# Altium schematic sheet VESC_KS75600_main_power.SchDoc
size A3; SheetNumber: 2; SheetTotal: 5
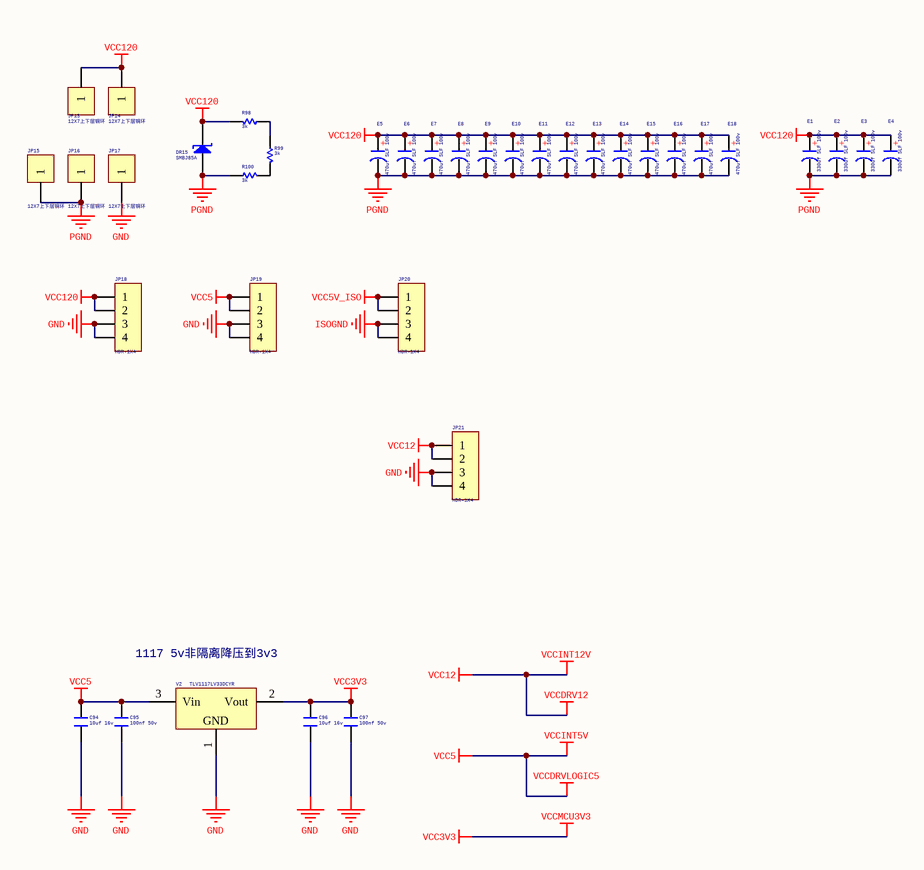
[diagram p0: VESC_KS75600_main_power.SchDoc]

## Parts
C94  10uf 16v  [C 0805]
C95  100nf 50v  [C 0603]
C96  10uf 16v  [C 0805]
C97  100nf 50v  [C 0603]
DR15  SMBJ85A  [SMB]
E1  330uf SLF 100v  [CAP 5.0*13.5*26]
E2  330uf SLF 100v  [CAP 5.0*13.5*26]
E3  330uf SLF 100v  [CAP 5.0*13.5*26]
E4  330uf SLF 100v  [CAP 5.0*13.5*26]
E5  470uf SLF 100v  [CAP 7.5*16.5*27]
E6  470uf SLF 100v  [CAP 7.5*16.5*27]
E7  470uf SLF 100v  [CAP 7.5*16.5*27]
E8  470uf SLF 100v  [CAP 7.5*16.5*27]
E9  470uf SLF 100v  [CAP 7.5*16.5*27]
E10  470uf SLF 100v  [CAP 7.5*16.5*27]
E11  470uf SLF 100v  [CAP 7.5*16.5*27]
E12  470uf SLF 100v  [CAP 7.5*16.5*27]
E13  470uf SLF 100v  [CAP 7.5*16.5*27]
E14  470uf SLF 100v  [CAP 7.5*16.5*27]
E15  470uf SLF 100v  [CAP 7.5*16.5*27]
E16  470uf SLF 100v  [CAP 7.5*16.5*27]
E17  470uf SLF 100v  [CAP 7.5*16.5*27]
E18  470uf SLF 100v  [CAP 7.5*16.5*27]
JP13  12X7上下层铜环  [12x7上下层铜环]
JP14  12X7上下层铜环  [12x7上下层铜环]
JP15  12X7上下层铜环  [12x7上下层铜环]
JP16  12X7上下层铜环  [12x7上下层铜环]
JP17  12X7上下层铜环  [12x7上下层铜环]
JP18  HDR-1X4  [HDR-1X4]
JP19  HDR-1X4  [HDR-1X4]
JP20  HDR-1X4  [HDR-1X4]
JP21  HDR-1X4  [HDR-1X4]
R98  3k  [R 2512]
R99  3k  [R 2512]
R100  3k  [R 2512]
V2  TLV1117LV33DCYR  [SOT223_L]

## Nets
GND: C94.2 C95.2 C96.2 C97.2 JP17.1 JP18.3 JP18.4 JP19.3 JP19.4 JP21.3 JP21.4 V2.1(GND)
ISOGND: JP20.3 JP20.4
PGND: DR15.1(A) E1.2 E2.2 E3.2 E4.2 E5.2 E6.2 E7.2 E8.2 E9.2 E10.2 E11.2 E12.2 E13.2 E14.2 E15.2 E16.2 E17.2 E18.2 JP15.1 JP16.1 R100.1
VCC3V3: C96.1 C97.1 V2.2(Vout)  [also labelled VCCMCU3V3]
VCC5: C94.1 C95.1 JP19.1 JP19.2 V2.3(Vin)  [also labelled VCCDRVLOGIC5, VCCINT5V]
VCC5V_ISO: JP20.1 JP20.2
VCC12: JP21.1 JP21.2  [also labelled VCCDRV12, VCCINT12V]
VCC120: DR15.2(K) E1.1 E2.1 E3.1 E4.1 E5.1 E6.1 E7.1 E8.1 E9.1 E10.1 E11.1 E12.1 E13.1 E14.1 E15.1 E16.1 E17.1 E18.1 JP13.1 JP14.1 JP18.1 JP18.2 R98.2
NetR98_1: R98.1 R99.1
NetR99_2: R99.2 R100.2

## Notes on the sheet
- 1117 5v非隔离降压到3v3
- (in symbol C-CAP) +

## Library data of the parts
C94-C97 = C: 无极性贴片电容
  C94 C96: Voltage: 16v; Value: 10uf
  C95 C97: Voltage: 50v; Value: 100nf
DR15 = DR_S: 瞬态电压抑制二极管(单向)
E1-E18 = C-CAP: 直插电解电容; Voltage: 100v
  E1-E4: Value: 330uf SLF
  E5-E18: Value: 470uf SLF
JP13-JP17 = Header 1: 1P接插件
JP18-JP21 = Header 4: 4P接插件
R98-R100 = R: 贴片电阻; Value: 3k
V2 = AMS1117: 三端稳压芯片